# Altium schematic sheet MidPwm.SchDoc
size A4
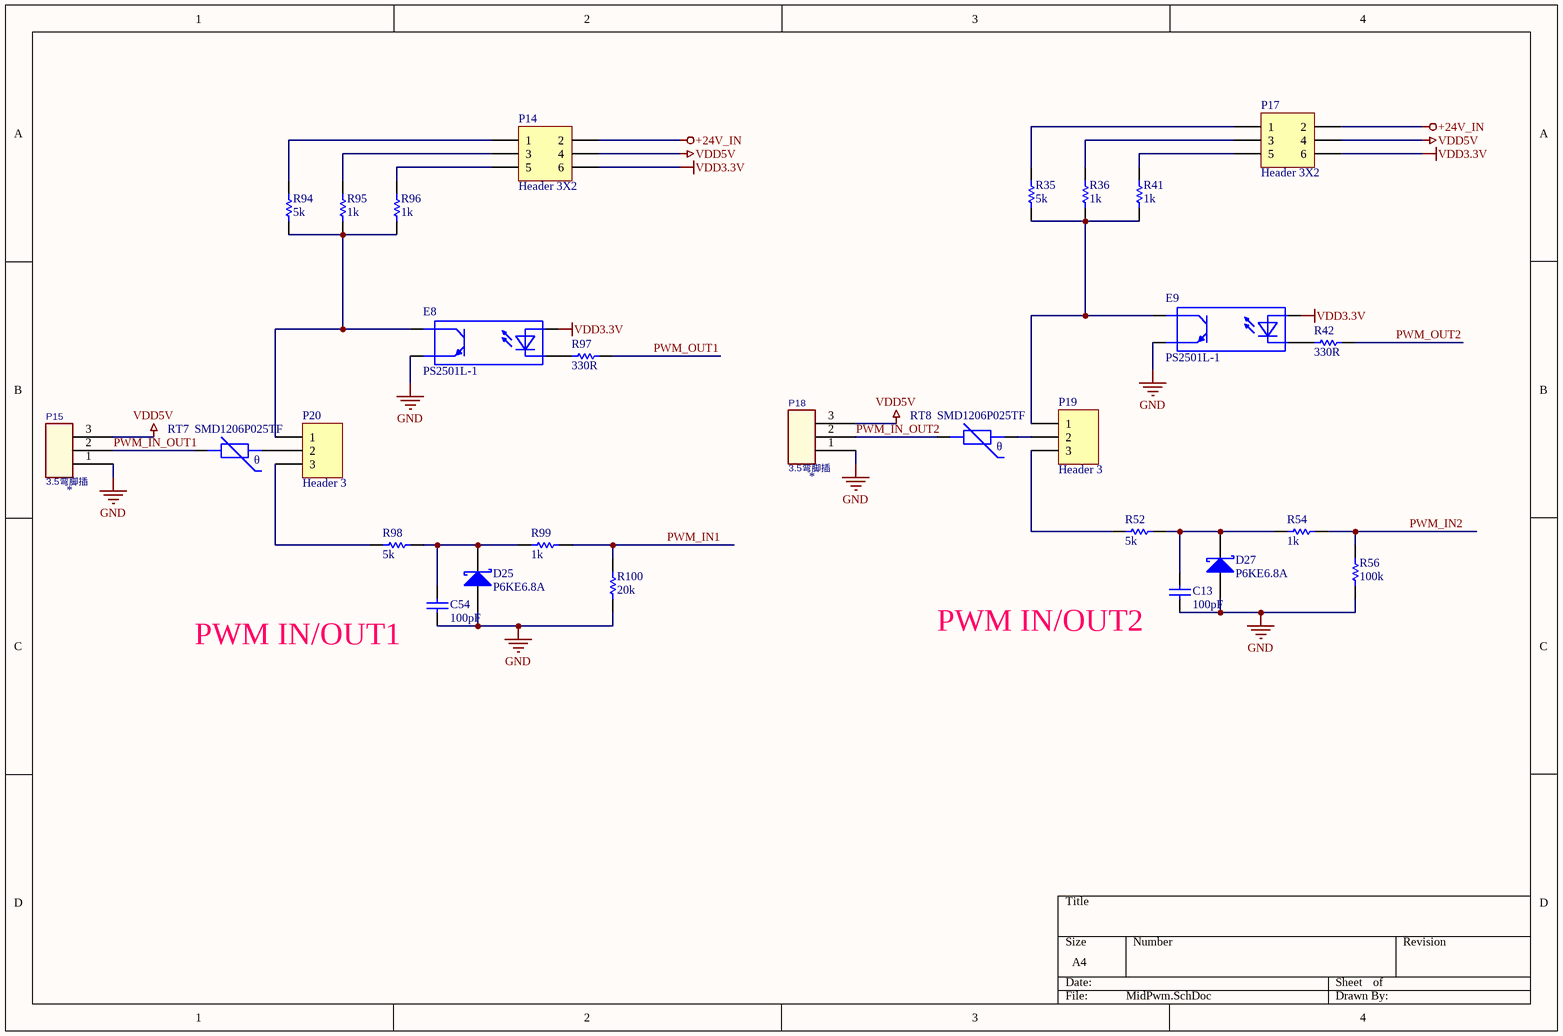
[diagram p0: MidPwm.SchDoc]

## Parts
C13  value 100pF  [C0805]  (hidden comment: Cap)
C54  value 100pF  [C0805]  (hidden comment: Cap)
D25  P6KE6.8A  [SMB]
D27  P6KE6.8A  [SMB]
E8  PS2501L-1  [NEC2501]
E9  PS2501L-1  [NEC2501]
P14  Header 3X2  [HDR2X3]
P15  *  [3.5-P3]
P17  Header 3X2  [HDR2X3]
P18  *  [3.5-P3]
P19  Header 3  [HDR1X3]
P20  Header 3  [HDR1X3]
R35  value 5k  [0805]  (hidden comment: Res Semi)
R36  value 1k  [0805]  (hidden comment: Res Semi)
R41  value 1k  [0805]  (hidden comment: Res Semi)
R42  value 330R  [0805]  (hidden comment: Res Semi)
R52  value 5k  [0805]  (hidden comment: Res Semi)
R54  value 1k  [0805]  (hidden comment: Res Semi)
R56  value 100k  [0805]  (hidden comment: Res Semi)
R94  value 5k  [0805]  (hidden comment: Res Semi)
R95  value 1k  [0805]  (hidden comment: Res Semi)
R96  value 1k  [0805]  (hidden comment: Res Semi)
R97  value 330R  [0805]  (hidden comment: Res Semi)
R98  value 5k  [0805]  (hidden comment: Res Semi)
R99  value 1k  [0805]  (hidden comment: Res Semi)
R100  value 20k  [0805]  (hidden comment: Res Semi)
RT7  SMD1206P025TF  [1206]
RT8  SMD1206P025TF  [1206]

## Nets
+24V_IN: P14.2 P17.2
GND: C13.2 C54.2 D25.1(A) D27.1(A) E8.3 E9.3 P15.1 P18.1 R56.2 R100.2
VDD3.3V: E8.1 E9.1 P14.6 P17.6
VDD5V: P14.4 P15.3 P17.4 P18.3
PWM_IN1: R99.2 R100.1
PWM_IN2: R54.2 R56.1
PWM_IN_OUT1: P15.2 RT7.1
PWM_IN_OUT2: P18.2 RT8.1
PWM_OUT1: R97.2
PWM_OUT2: R42.2
NetC13_1: C13.1 D27.2(K) R52.2 R54.1
NetC54_1: C54.1 D25.2(K) R98.2 R99.1
NetE8_2: E8.2 R97.1
NetE8_4: E8.4 P20.1 R94.2 R95.2 R96.2
NetE9_2: E9.2 R42.1
NetE9_4: E9.4 P19.1 R35.2 R36.2 R41.2
NetP14_1: P14.1 R94.1
NetP14_3: P14.3 R95.1
NetP14_5: P14.5 R96.1
NetP17_1: P17.1 R35.1
NetP17_3: P17.3 R36.1
NetP17_5: P17.5 R41.1
NetP19_2: P19.2 RT8.2
NetP19_3: P19.3 R52.1
NetP20_2: P20.2 RT7.2
NetP20_3: P20.3 R98.1

## Notes on the sheet
- PWM IN/OUT1
- PWM IN/OUT2
- (in symbol CON3) 3.5弯脚插
- (in symbol PTC) θ

## Library data of the parts
C13 C54 = Cap: Capacitor; Manufacturer: Generic Components; Class: Passive; Published: 08/06/2000; Publisher: Altium Hobart Technology Centre; SubClass: Capacitor
D25 D27 = D Schottky: Schottky Diode; Published: 8-Jun-2000; LatestRevisionDate: 17-Jul-2002; LatestRevisionNote: Re-released for DXP Platform.; PackageReference: SMB; Publisher: Altium Limited; Code_JEDEC: DO-214-AA
E8 E9 = OPT: 光耦
P14 P17 = Header 3X2: Header, 3-Pin, Dual row; LatestRevisionDate: 17-Jul-2002; LatestRevisionNote: Re-released for DXP Platform.; Publisher: Altium Limited
P15 P18 = CON3: PCB Footprint SM: 插件; TOLERANCE: =J57_TOLERANCE
P19 P20 = Header 3: Header, 3-Pin; LatestRevisionDate: 17-Jul-2002; LatestRevisionNote: Re-released for DXP Platform.; Publisher: Altium Limited
R35 R36 R41 R42 R52 R54 R56 R94-R100 = Res Semi: Semiconductor Resistor; Published: 8-Jun-2000; LatestRevisionDate: 17-Jul-2002; LatestRevisionNote: Re-released for DXP Platform.; PackageReference: AXIAL-0.5; Publisher: Altium Limited
RT7 RT8 = PTC: 热敏电阻